# Altium schematic sheet P24_AUDIO.SchDoc
size 420 x 297 mm
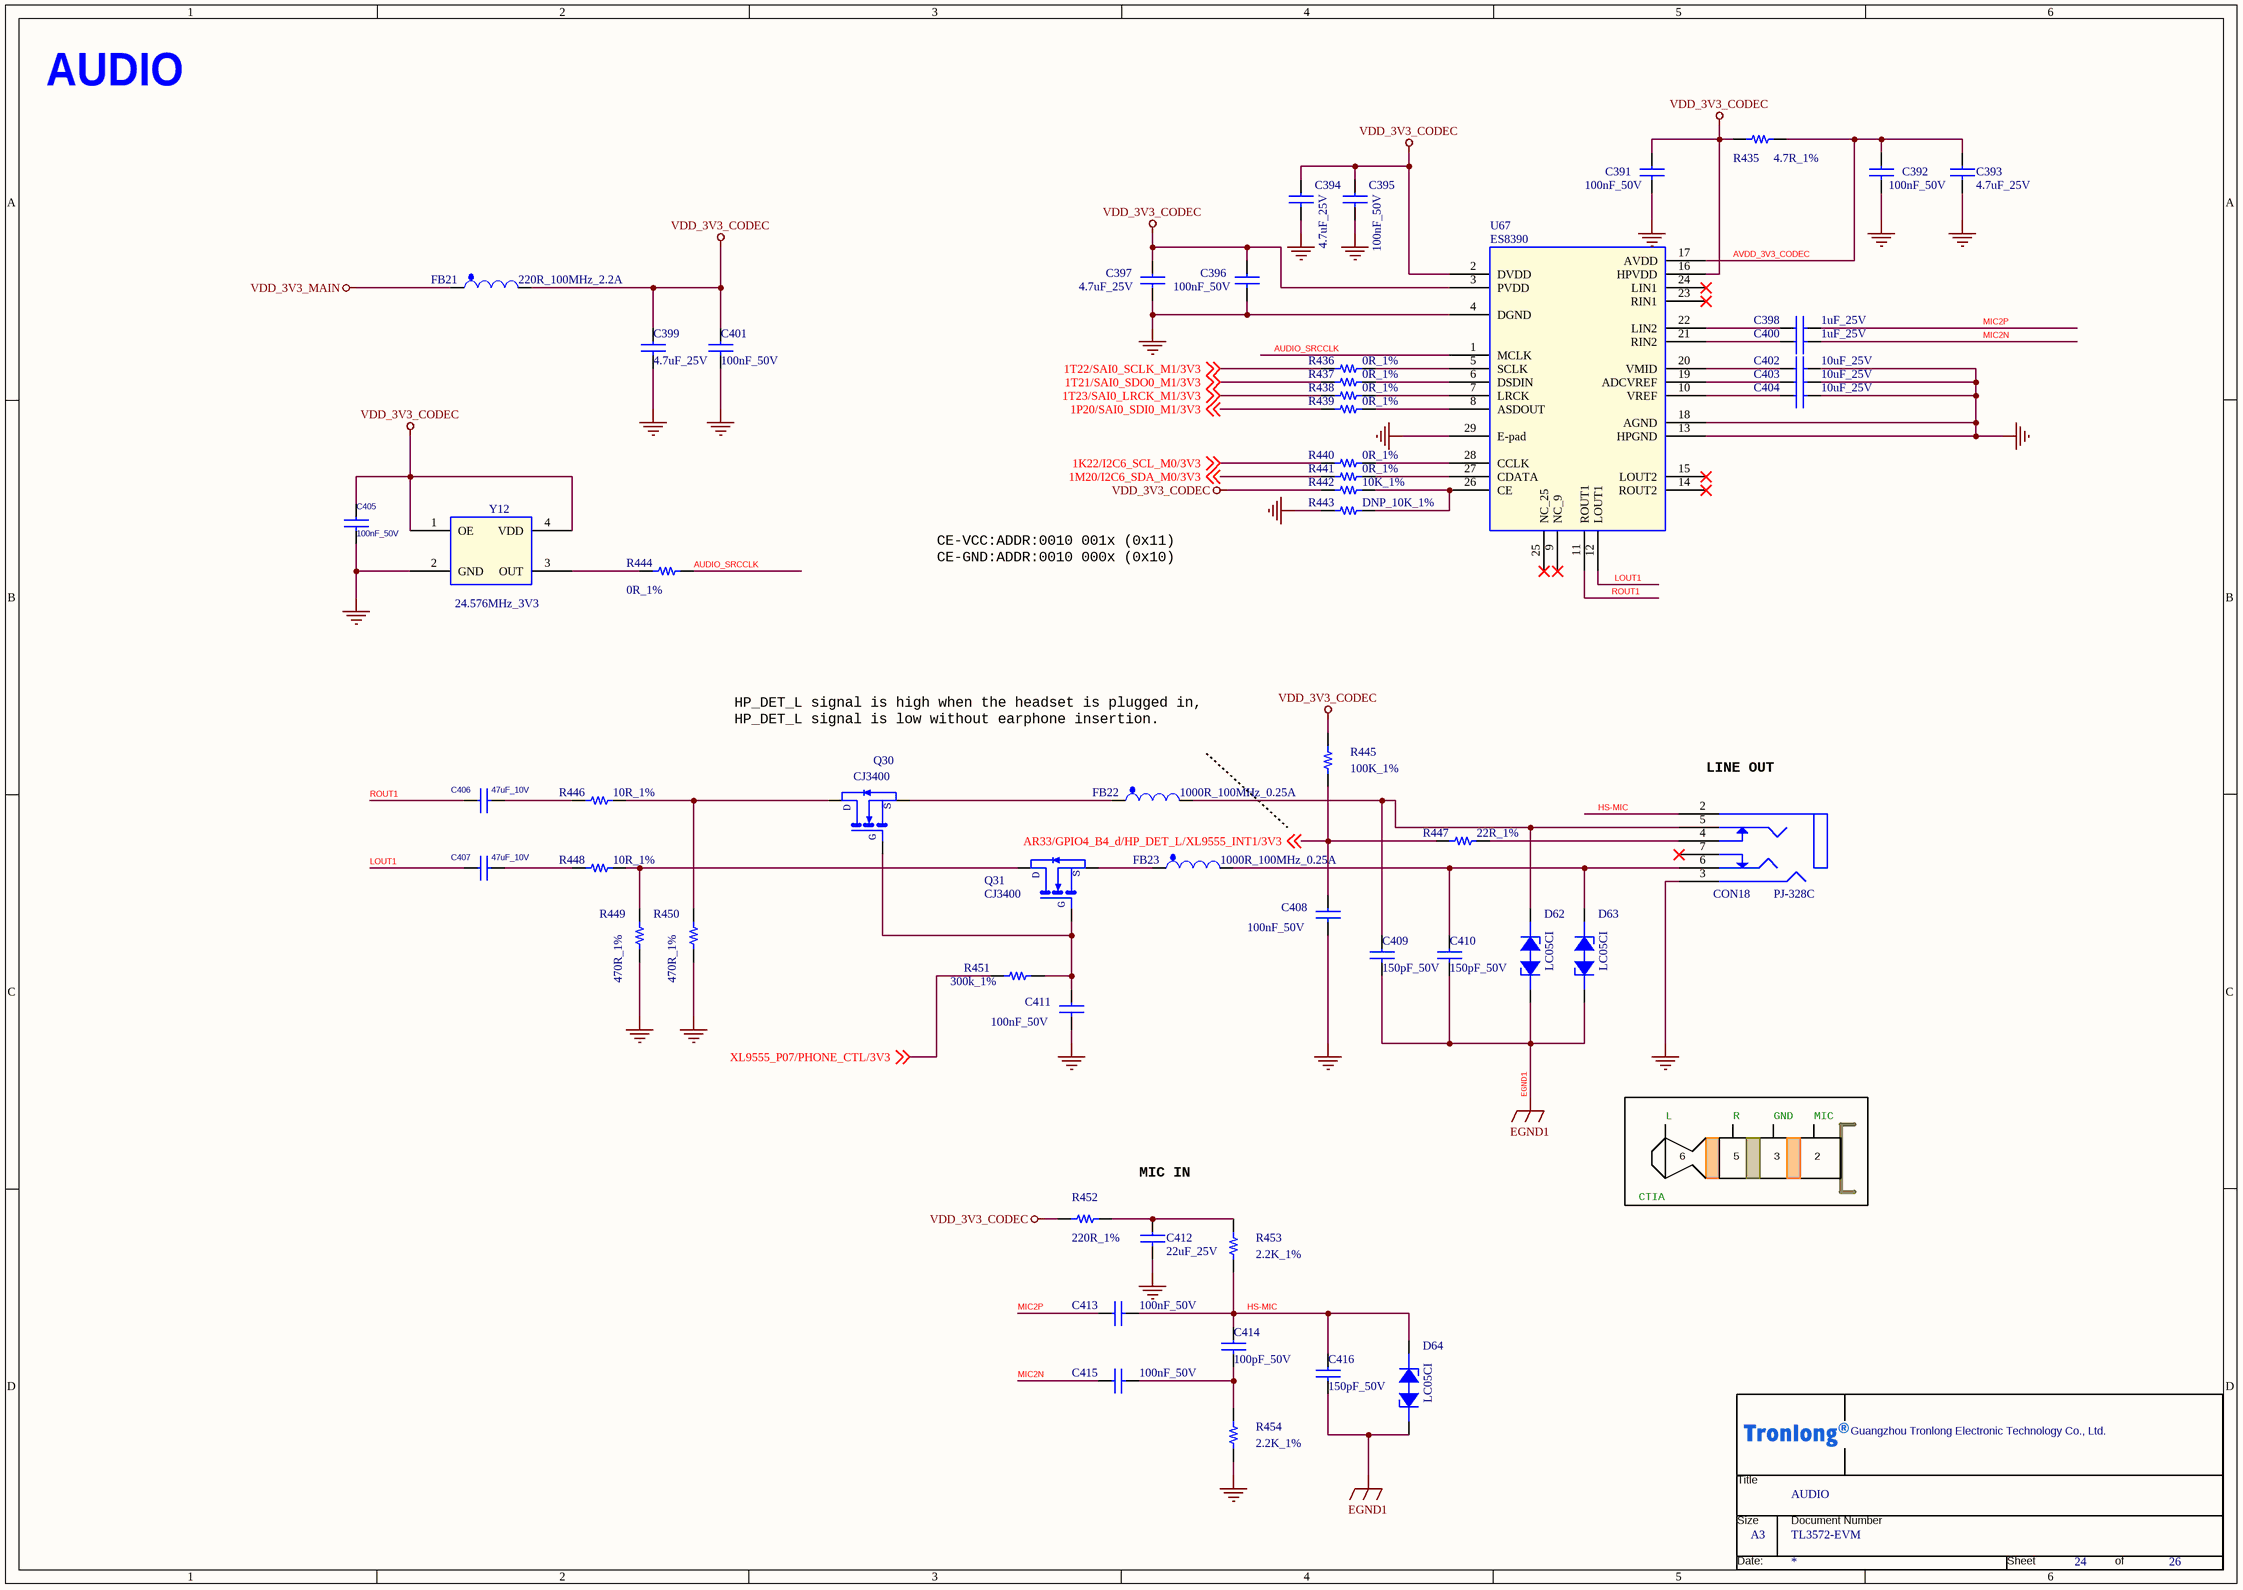
[diagram p0: P24_AUDIO.SchDoc]

## Parts
*  Page Count: 26  Page Number: 24  Page Size: A3  OrgName: Guangzhou Tronlong Electronic Technology Co., Ltd.  Title: AUDIO  Doc: TL3572-EVM  (hidden comment: TL_NEW)  (graphical)
C391  100nF_50V  [C0402]
C392  100nF_50V  [C0402]
C393  4.7uF_25V  [C0603]
C394  4.7uF_25V  [C0603]
C395  100nF_50V  [C0402]
C396  100nF_50V  [C0402]
C397  4.7uF_25V  [C0603]
C398  1uF_25V  [C0402]
C399  4.7uF_25V  [C0603]
C400  1uF_25V  [C0402]
C401  100nF_50V  [C0402]
C402  10uF_25V  [C0603]
C403  10uF_25V  [C0603]
C404  10uF_25V  [C0603]
C405  100nF_50V  [C0402]
C406  47uF_10V  [C0805]
C407  47uF_10V  [C0805]
C408  100nF_50V  [C0402]
C409  150pF_50V  [C0603]
C410  150pF_50V  [C0603]
C411  100nF_50V  [C0402]
C412  22uF_25V  [C0805]
C413  100nF_50V  [C0402]
C414  100pF_50V  [C0402]
C415  100nF_50V  [C0402]
C416  150pF_50V  [C0603]
CON18  PJ-328C  [PJ-328C]
D62  LC05CI  [SOD323]
D63  LC05CI  [SOD323]
D64  LC05CI  [SOD323]
FB21  220R_100MHz_2.2A  [L0603]
FB22  1000R_100MHz_0.25A  [L0402]
FB23  1000R_100MHz_0.25A  [L0402]
Q30  CJ3400  [SOT23-3]
Q31  CJ3400  [SOT23-3]
R435  4.7R_1%  [R0603]
R436  0R_1%  [R0402]
R437  0R_1%  [R0402]
R438  0R_1%  [R0402]
R439  0R_1%  [R0402]
R440  0R_1%  [R0402]
R441  0R_1%  [R0402]
R442  10K_1%  [R0402]
R443  DNP_10K_1%  [R0402]
R444  0R_1%  [R0603]
R445  100K_1%  [R0402]
R446  10R_1%  [R0603]
R447  22R_1%  [R0402]
R448  10R_1%  [R0603]
R449  470R_1%  [R0603]
R450  470R_1%  [R0603]
R451  300k_1%  [R0402]
R452  220R_1%  [R0603]
R453  2.2K_1%  [R0603]
R454  2.2K_1%  [R0603]
U67  ES8390  [QFN28_ES8388]
Y12  24.576MHz_3V3  [SMD_3225]

## Nets
EGND1: C409.2 C410.2 C416.2 D62.2(CATHODE2) D63.2(CATHODE2) D64.2(CATHODE2)
GND: C391.2 C392.2 C393.2 C394.2 C395.2 C396.2 C397.2 C399.2 C401.2 C402.2 C403.2 C404.2 C405.2 C408.2 C411.2 C412.2 CON18.3(GND) R443.1 R449.1 R450.1 R454.2 U67.4(DGND) U67.13(HPGND) U67.18(AGND) U67.29(E-pad) Y12.2(GND)
VDD_3V3_CODEC: C391.1 C394.1 C395.1 C396.1 C397.1 C399.1 C401.1 C405.1 FB21.2 R435.2 R442.1 R445.1 R452.1 U67.2(DVDD) U67.3(PVDD) U67.16(HPVDD) Y12.1(OE) Y12.4(VDD)
VDD_3V3_MAIN: FB21.1
1K22/I2C6_SCL_M0/3V3: R440.1 ; off-sheet 1K22/I2C6_SCL_M0/3V3
1M20/I2C6_SDA_M0/3V3: R441.1 ; off-sheet 1M20/I2C6_SDA_M0/3V3
1P20/SAI0_SDI0_M1/3V3: R439.1 ; off-sheet 1P20/SAI0_SDI0_M1/3V3
1T21/SAI0_SDO0_M1/3V3: R437.1 ; off-sheet 1T21/SAI0_SDO0_M1/3V3
1T22/SAI0_SCLK_M1/3V3: R436.1 ; off-sheet 1T22/SAI0_SCLK_M1/3V3
1T23/SAI0_LRCK_M1/3V3: R438.1 ; off-sheet 1T23/SAI0_LRCK_M1/3V3
AR33/GPIO4_B4_d/HP_DET_L/XL9555_INT1/3V3: C408.1 R445.2 R447.1 ; off-sheet AR33/GPIO4_B4_d/HP_DET_L/XL9555_INT1/3V3
AUDIO_SRCCLK: R444.2 U67.1(MCLK)
AVDD_3V3_CODEC: C392.1 C393.1 R435.1 U67.17(AVDD)
HS-MIC: C413.2 C414.1 C416.1 CON18.2(MIC) D64.1(ANODE1) R453.2
LOUT1: C407.1 U67.12(LOUT1)
MIC2N: C400.2 C415.1
MIC2P: C398.2 C413.1
ROUT1: C406.1 U67.11(ROUT1)
XL9555_P07/PHONE_CTL/3V3: R451.2 ; off-sheet XL9555_P07/PHONE_CTL/3V3
NetC398_1: C398.1 U67.22(LIN2)
NetC400_1: C400.1 U67.21(RIN2)
NetC402_1: C402.1 U67.20(VMID)
NetC403_1: C403.1 U67.19(ADCVREF)
NetC404_1: C404.1 U67.10(VREF)
NetC406_2: C406.2 R446.1
NetC407_2: C407.2 R448.1
NetC409_1: C409.1 CON18.5(R) D62.1(ANODE1) FB22.2
NetC410_1: C410.1 CON18.6(L) D63.1(ANODE1) FB23.2
NetC411_1: C411.1 Q30.1(B) Q31.1(B) R451.1
NetC412_1: C412.1 R452.2 R453.1
NetC414_2: C414.2 C415.2 R454.1
NetCON18_4: CON18.4(DETR) R447.2
NetFB22_1: FB22.1 Q30.2(E)
NetFB23_1: FB23.1 Q31.2(E)
NetQ30_3: Q30.3(C) R446.2 R450.2
NetQ31_3: Q31.3(C) R448.2 R449.2
NetR436_2: R436.2 U67.5(SCLK)
NetR437_2: R437.2 U67.6(DSDIN)
NetR438_2: R438.2 U67.7(LRCK)
NetR439_2: R439.2 U67.8(ASDOUT)
NetR440_2: R440.2 U67.28(CCLK)
NetR441_2: R441.2 U67.27(CDATA)
NetR442_2: R442.2 R443.2 U67.26(CE)
NetR444_1: R444.1 Y12.3(OUT)

Not connected (* = marked no-connect by the designer): CON18 7(DETL)*; U67 9(NC_9)* 14(ROUT2)* 15(LOUT2)* 23(RIN1)* 24(LIN1)* 25(NC_25)*

## Notes on the sheet
- AUDIO
- CE-VCC:ADDR:0010 001x (0x11)
  CE-GND:ADDR:0010 000x (0x10)
- HP_DET_L signal is high when the headset is plugged in,
  HP_DET_L signal is low without earphone insertion.
- (near CON18) LINE OUT
- L
- R
- GND
- MIC
- MIC IN
- CTIA
- 6
- 5
- 3
- 2
- (in symbol MMBT3904/SOT_1) S; D; G
- (in symbol TL_NEW) Title; Size; Document Number; Date:; Sheet; of

## Library data of the parts
* = TL_NEW: RevCode: A?; Page Create Date: March  8, 1995; Page Modify Date: *; Document: TL3572-EVM
C391 = CAP NP_Dup3: 贴片陶瓷电容,100nF,10%,50V,X7R; Manufacturer: 广东风华高新科技股份有限公司（FH）; Manufacturer Character: 中国大陆; Manufacturer PartNumber: 0402B104K500NT; As-Welded: /; ERP Number: 005.0001.0001.00681; Operation Temperature（℃）: -55~+125(Ta); Eco-Label: ROHS; Part Status: 试用; PCB Footprint: C0402
C392 = CAP NP_Dup3: 贴片陶瓷电容,100nF,10%,50V,X7R; Manufacturer Character: 中国大陆; Manufacturer PartNumber: 0402B104K500NT; Manufacturer: 广东风华高新科技股份有限公司（FH）; Eco-Label: ROHS; Operation Temperature（℃）: -55~+125(Ta); ERP Number: 005.0001.0001.00681; As-Welded: /; Part Status: 试用; PCB Footprint: C0402
C393 = CAP NP_Dup3: 贴片陶瓷电容,4.7uF,10%,25V,X5R; Manufacturer: 广东风华高新科技股份有限公司（FH）; Manufacturer PartNumber: 0603X475K250NT; Manufacturer Character: 中国大陆; Operation Temperature（℃）: -55~+85(Ta); As-Welded: /; ERP Number: 005.0001.0001.00566; Eco-Label: ROHS; Part Status: 优选; PCB Footprint: C0603
C394 C397 = CAP NP_Dup3: 贴片陶瓷电容,4.7uF,10%,25V,X5R; Manufacturer: 广东风华高新科技股份有限公司（FH）; Manufacturer Character: 中国大陆; Manufacturer PartNumber: 0603X475K250NT; Operation Temperature（℃）: -55~+85(Ta); As-Welded: /; ERP Number: 005.0001.0001.00566; Eco-Label: ROHS; Part Status: 优选; PCB Footprint: C0603
C395 = CAP NP_Dup3: 贴片陶瓷电容,100nF,10%,50V,X7R; Manufacturer PartNumber: 0402B104K500NT; Manufacturer Character: 中国大陆; Manufacturer: 广东风华高新科技股份有限公司（FH）; Eco-Label: ROHS; Operation Temperature（℃）: -55~+125(Ta); ERP Number: 005.0001.0001.00681; As-Welded: /; Part Status: 试用; PCB Footprint: C0402
C396 = CAP NP_Dup3: 贴片陶瓷电容,100nF,10%,50V,X7R; Manufacturer: 广东风华高新科技股份有限公司（FH）; Manufacturer PartNumber: 0402B104K500NT; Manufacturer Character: 中国大陆; As-Welded: /; ERP Number: 005.0001.0001.00681; Operation Temperature（℃）: -55~+125(Ta); Eco-Label: ROHS; Part Status: 试用; PCB Footprint: C0402
C398 C400 = CAP NP_Dup3: 贴片陶瓷电容,1uF,10%,25V,X5R; Manufacturer Character: 中国大陆; Manufacturer PartNumber: 0402X105K250NT; Manufacturer: 广东风华高新科技股份有限公司（FH）; Eco-Label: ROHS; ERP Number: 005.0001.0001.00640; As-Welded: /; Operation Temperature（℃）: -55~+85(Ta); Part Status: 试用; PCB Footprint: C0402
C399 = CAP NP_Dup3: 贴片陶瓷电容,4.7uF,10%,25V,X5R; Manufacturer Character: 中国大陆; Manufacturer PartNumber: 0603X475K250NT; Manufacturer: 广东风华高新科技股份有限公司（FH）; Eco-Label: ROHS; ERP Number: 005.0001.0001.00566; As-Welded: /; Operation Temperature（℃）: -55~+85(Ta); Part Status: 优选; PCB Footprint: C0603
C401 C408 C411 = CAP NP_Dup3: 贴片陶瓷电容,100nF,10%,50V,X7R; Manufacturer Character: 中国大陆; Manufacturer PartNumber: 0402B104K500NT; Manufacturer: 广东风华高新科技股份有限公司（FH）; Eco-Label: ROHS; ERP Number: 005.0001.0001.00681; Operation Temperature（℃）: -55~+125(Ta); As-Welded: /; Part Status: 试用; PCB Footprint: C0402
C402 = CAP NP_Dup3: 贴片陶瓷电容,10uF,20%,25V,X5R; Manufacturer PartNumber: 0603X106M250NT; Manufacturer Character: 中国大陆; Manufacturer: 广东风华高新科技股份有限公司（FH）; Eco-Label: ROHS; ERP Number: 005.0001.0001.00527; As-Welded: /; Operation Temperature（℃）: -55~+85(Ta); Part Status: 优选; PCB Footprint: C0603
C403 = CAP NP_Dup3: 贴片陶瓷电容,10uF,20%,25V,X5R; Manufacturer Character: 中国大陆; Manufacturer PartNumber: 0603X106M250NT; Manufacturer: 广东风华高新科技股份有限公司（FH）; As-Welded: /; Operation Temperature（℃）: -55~+85(Ta); ERP Number: 005.0001.0001.00527; Eco-Label: ROHS; Part Status: 优选; PCB Footprint: C0603
C404 = CAP NP_Dup3: 贴片陶瓷电容,10uF,20%,25V,X5R; Manufacturer: 广东风华高新科技股份有限公司（FH）; Manufacturer Character: 中国大陆; Manufacturer PartNumber: 0603X106M250NT; As-Welded: /; Operation Temperature（℃）: -55~+85(Ta); ERP Number: 005.0001.0001.00527; Eco-Label: ROHS; Part Status: 优选; PCB Footprint: C0603
C405 = CAP NP_Dup2: 贴片陶瓷电容,100nF,10%,50V,X7R; Manufacturer: 广东风华高新科技股份有限公司（FH）; Manufacturer PartNumber: 0402B104K500NT; Manufacturer Character: 中国大陆; Eco-Label: ROHS; As-Welded: /; Operation Temperature（℃）: -55~+125(Ta); ERP Number: 005.0001.0001.00681; Part Status: 试用; PCB Footprint: C0402
C406 C407 = CAP NP_Dup3: 贴片陶瓷电容,47uF,20%,10V,X5R; Manufacturer Character: 中国大陆; Manufacturer PartNumber: 0805X476M100NT; Manufacturer: 广东风华高新科技股份有限公司（FH）; Eco-Label: ROHS; ERP Number: 005.0001.0001.00621; As-Welded: /; Operation Temperature（℃）: -55~+85(Ta); Part Status: 试用; Temperature: -55~125℃; PCB Footprint: C0805
C409 = CAP NP_Dup2: 贴片陶瓷电容,150pF,5%,50V,COG; Manufacturer PN: C1005C0G1H101K050BA; Manufacturer: 广东风华高新科技股份有限公司（FH）; Manufacturer Character: 中国大陆; Manufacturer PartNumber: 0603CG151J500NT; As-Welded: /; Dielectric: C0G; Priority: A; Operation Temperature（℃）: -55~+125(Ta); ERP Number: 005.0001.0001.00611; Eco-Label: ROHS; Part Status: 试用; Part Type: C0402; RK PN: C1005C0G1H101K050BA; PCB Footprint: C0603
C410 C416 = CAP NP_Dup2: 贴片陶瓷电容,150pF,5%,50V,COG; Manufacturer PartNumber: 0603CG151J500NT; Manufacturer Character: 中国大陆; Manufacturer: 广东风华高新科技股份有限公司（FH）; ERP Number: 005.0001.0001.00611; Operation Temperature（℃）: -55~+125(Ta); RK PN: C1005C0G1H101K050BA; Priority: A; Dielectric: C0G; As-Welded: /; Eco-Label: ROHS; Part Status: 试用; Part Type: C0402; Manufacturer PN: C1005C0G1H101K050BA; PCB Footprint: C0603
C412 = CAP NP_Dup3: 贴片陶瓷电容,22uF,20%,25V,X5R; Manufacturer: 广东风华高新科技股份有限公司（FH）; Manufacturer Character: 中国大陆; Manufacturer PartNumber: 0805X226M250NT; Operation Temperature（℃）: -55~+85(Ta); As-Welded: /; ERP Number: 005.0001.0001.00524; Eco-Label: ROHS; Part Status: 优选; PCB Footprint: C0805
C413 C415 = CAP NP_Dup3: 贴片陶瓷电容,100nF,10%,50V,X7R; Manufacturer Character: 中国大陆; Manufacturer: 广东风华高新科技股份有限公司（FH）; Manufacturer PartNumber: 0402B104K500NT; Eco-Label: ROHS; ERP Number: 005.0001.0001.00681; As-Welded: /; Operation Temperature（℃）: -55~+125(Ta); RK PN: C1005C0G1H101K050BA; Priority: A; Dielectric: C0G; Part Type: C0402; Voltage: 50V; Tolerance: 10%; Manufacturer PN: C1005C0G1H101K050BA; Created by: JJJ; Part Status: 试用; PCB Footprint: C0402
C414 = CAP NP_Dup3: 贴片陶瓷电容,100pF,5%,50V,COG; Manufacturer PartNumber: 0402CG101J500NT; Manufacturer PN: C1005C0G1H101K050BA; Manufacturer: 广东风华高新科技股份有限公司（FH）; Manufacturer Character: 中国大陆; Tolerance: 10%; Dielectric: C0G; Priority: A; Operation Temperature（℃）: -55~+125(Ta); As-Welded: /; ERP Number: 005.0001.0001.00580; Eco-Label: EXEMPTION; Part Status: 优选; Created by: JJJ; Voltage: 50V; Part Type: C0402; RK PN: C1005C0G1H101K050BA; PCB Footprint: C0402
CON18 = PJ-328C_0: 插件音频连接器,孔径3.5mm,黑色; Manufacturer Character: 中国大陆; Manufacturer: 深圳市金航标电子有限公司(kinghelm); Eco-Label: ROHS; ERP Number: 005.0001.0003.00628; As-Welded: /; Part Status: 试用; Manufacturer PartNumber: PJ-328C; Operation Temperature（℃）: /; PCB Footprint: PJ-328C
D62 = DIODE BREAKDOWN_2: TVS二极管,VRWM=5V,VBR=6V,一组,双向,30KV,30KV; Manufacturer Character: 中国大陆; Manufacturer: 上海雷卯电子科技有限公司（Leiditech）; Eco-Label: ROHS; ERP Number: 005.0001.0017.00060; As-Welded: /; room: KEY; Operation Temperature（℃）: -55~+125(Tj); Manufacturer PartNumber: LC05CI; Manufacturer Part Number: LC05CI; Temperature: -55~125℃; Part Status: 优选; PCB Footprint: SOD323
D63 D64 = DIODE BREAKDOWN_2: TVS二极管,VRWM=5V,VBR=6V,一组,双向,30KV,30KV; Manufacturer: 上海雷卯电子科技有限公司（Leiditech）; Manufacturer Character: 中国大陆; Eco-Label: ROHS; ERP Number: 005.0001.0017.00060; As-Welded: /; Operation Temperature（℃）: -55~+125(Tj); room: KEY; Temperature: -55~125℃; Manufacturer Part Number: LC05CI; Manufacturer PartNumber: LC05CI; Part Status: 优选; PCB Footprint: SOD323
FB21 = FB_0: 磁珠,50mΩ,2.2A,220R@100MHz; Manufacturer PartNumber: UPZ1608U221-2R2TF; Manufacturer: 深圳顺络电子股份有限公司（Sunlord）; Manufacturer Character: 中国大陆; As-Welded: /; ERP Number: 005.0001.0007.00015; PCB Footprint Status: Checked; Standard PCB Footprint: 603; Purchase Information: 07558255526 小商行电子; Operation Temperature（℃）: -55~+125(Ta); Eco-Label: ROHS; Temperature: -55~125℃; Part Number: 647-01-3069; Part Type: BEAD; Price: 0.011; Part Status: 限选; PCB Footprint: L0603
FB22 = FB_0: 磁珠,900mΩ,0.25A,1000R@100MHz; Manufacturer Character: 中国大陆; Manufacturer: 广东风华高新科技股份有限公司(FH); Manufacturer PartNumber: CBW100505U102T; Eco-Label: ROHS; Operation Temperature（℃）: -55~+125(Ta); Purchase Information: 07558255526 小商行电子; Standard PCB Footprint: 603; PCB Footprint Status: Checked; ERP Number: 005.0001.0007.00021; As-Welded: /; Part Status: 试用; Price: 0.011; Part Type: BEAD; Part Number: 647-01-3069; Temperature: -55~125℃; PCB Footprint: L0402
FB23 = FB_0: 磁珠,900mΩ,0.25A,1000R@100MHz; Manufacturer PartNumber: CBW100505U102T; Manufacturer: 广东风华高新科技股份有限公司(FH); Manufacturer Character: 中国大陆; As-Welded: /; ERP Number: 005.0001.0007.00021; PCB Footprint Status: Checked; Standard PCB Footprint: 603; Purchase Information: 07558255526 小商行电子; Operation Temperature（℃）: -55~+125(Ta); Eco-Label: ROHS; Temperature: -55~125℃; Part Number: 647-01-3069; Part Type: BEAD; Price: 0.011; Part Status: 试用; PCB Footprint: L0402
Q30 = MMBT3904/SOT_1: MOSFET,N沟道,VDSS=30V,VGSS=±12V,ID=5.8A,PD=0.35W,VGS(th)=1.4V; Manufacturer: 江苏长晶科技股份有限公司（JSCJ）; Manufacturer Character: 中国大陆; Eco-Label: ROHS; ERP Number: 005.0001.0009.00027; As-Welded: /; Operation Temperature（℃）: -55~+150(Tj); ROOM: DSP_LED; Part Status: 优选; Manufacturer PartNumber: CJ3400; PCB Footprint: SOT23-3
Q31 = MMBT3904/SOT_1: MOSFET,N沟道,VDSS=30V,VGSS=±12V,ID=5.8A,PD=0.35W,VGS(th)=1.4V; Manufacturer Character: 中国大陆; Manufacturer: 江苏长晶科技股份有限公司（JSCJ）; ROOM: DSP_LED; Operation Temperature（℃）: -55~+150(Tj); As-Welded: /; ERP Number: 005.0001.0009.00027; Eco-Label: ROHS; Manufacturer PartNumber: CJ3400; Part Status: 优选; PCB Footprint: SOT23-3
R435 = Resistor_Dup4: /; Manufacturer PartNumber: 4.7R,±1%,R0603,≥1/10W; Manufacturer: 广州创龙; CLASS: DISCRETE; Eco-Label: ROHS; ERP Number: 005.0001.0023.00441; Operation Temperature（℃）: -40~+85(Ta); As-Welded: /; Manufacturer Character: -; Part Status: -; PCB Footprint: R0603
R436 R437 = Resistor_Dup4: 贴片电阻,0R,±1%,1/16W; Manufacturer: 广东风华高新科技股份有限公司（FH）; Manufacturer PartNumber: RC-02000FT; Manufacturer Character: 中国大陆; CLASS: DISCRETE; Operation Temperature（℃）: -55~+155(Ta); AGILE_PN: 470-75394; Tolerance: 5%; MFG_NAME01: ROHM; MFG_PN01: MCR01MZPJ000; CAD_APPROVED: Yes; FPLIST: RC0402_25,RC0402_HD,RC0402_X2,0402_CC; As-Welded: /; ERP Number: 005.0001.0002.00938; Eco-Label: ROHS; ROHS: Yes; HEIGHT: 0.45 MM; Part Status: 优选; PCB Footprint: R0402
R438 R439 R441 = Resistor_Dup4: 贴片电阻,0R,±1%,1/16W; Manufacturer Character: 中国大陆; Manufacturer PartNumber: RC-02000FT; Manufacturer: 广东风华高新科技股份有限公司（FH）; CLASS: DISCRETE; Eco-Label: ROHS; ERP Number: 005.0001.0002.00938; As-Welded: /; FPLIST: RC0402_25,RC0402_HD,RC0402_X2,0402_CC; CAD_APPROVED: Yes; MFG_PN01: MCR01MZPJ000; MFG_NAME01: ROHM; Tolerance: 5%; AGILE_PN: 470-75394; Operation Temperature（℃）: -55~+155(Ta); Part Status: 优选; HEIGHT: 0.45 MM; ROHS: Yes; PCB Footprint: R0402
R440 = Resistor_Dup4: 贴片电阻,0R,±1%,1/16W; Manufacturer Character: 中国大陆; Manufacturer PartNumber: RC-02000FT; Manufacturer: 广东风华高新科技股份有限公司（FH）; CLASS: DISCRETE; Eco-Label: ROHS; ERP Number: 005.0001.0002.00938; As-Welded: /; Operation Temperature（℃）: -55~+155(Ta); AGILE_PN: 470-75394; Tolerance: 5%; MFG_NAME01: ROHM; MFG_PN01: MCR01MZPJ000; CAD_APPROVED: Yes; FPLIST: RC0402_25,RC0402_HD,RC0402_X2,0402_CC; Part Status: 优选; ROHS: Yes; HEIGHT: 0.45 MM; PCB Footprint: R0402
R442 = Resistor_Dup4: 贴片电阻,10K,±1%,1/16W; Manufacturer: 广东风华高新科技股份有限公司（FH）; Manufacturer PartNumber: RC-02K1002FT; Manufacturer Character: 中国大陆; CLASS: DISCRETE; Eco-Label: ROHS; Operation Temperature（℃）: -55~+125(Ta); AGILE_PN: 470-75394; Tolerance: 5%; MFG_NAME01: ROHM; MFG_PN01: MCR01MZPJ000; CAD_APPROVED: Yes; FPLIST: RC0402_25,RC0402_HD,RC0402_X2,0402_CC; ERP Number: 005.0001.0002.01326; As-Welded: /; ROHS: Yes; HEIGHT: 0.45 MM; Part Status: 优选; PCB Footprint: R0402
R443 = Resistor_Dup4: 贴片电阻,10K,±1%,1/16W; Manufacturer Character: 中国大陆; Manufacturer PartNumber: RC-02K1002FT; Manufacturer: 广东风华高新科技股份有限公司（FH）; CLASS: DISCRETE; As-Welded: DNP; ERP Number: 005.0001.0002.01326; FPLIST: RC0402_25,RC0402_HD,RC0402_X2,0402_CC; CAD_APPROVED: Yes; MFG_PN01: MCR01MZPJ000; MFG_NAME01: ROHM; Tolerance: 5%; AGILE_PN: 470-75394; Operation Temperature（℃）: -55~+125(Ta); Eco-Label: ROHS; Part Status: 优选; HEIGHT: 0.45 MM; ROHS: Yes; PCB Footprint: R0402
R444 = Resistor_Dup3: 贴片电阻,0R,±1%,1/10W; Manufacturer: 广东风华高新科技股份有限公司（FH）; Manufacturer PartNumber: RS-03000FT; Manufacturer Character: 中国大陆; CLASS: DISCRETE; Eco-Label: ROHS; As-Welded: /; room: RS232; Operation Temperature（℃）: -55~+155(Ta); ERP Number: 005.0001.0002.00956; Part Status: 优选; PCB Footprint: R0603
R445 = Resistor_Dup4: RC0402FR-07100KL,0402WGF1003TCE; Manufacturer: 广州创龙; Manufacturer PartNumber: 100K,±1%,R0402,≥1/16W; CLASS: DISCRETE; FPLIST: RC0402_25,RC0402_HD,RC0402_X2,0402_CC; CAD_APPROVED: Yes; MFG_PN01: MCR01MZPJ000; MFG_NAME01: ROHM; Tolerance: 5%; AGILE_PN: 470-75394; Operation Temperature（℃）: -40~+85(Ta); As-Welded: /; ERP Number: 005.0001.0023.00025; Eco-Label: ROHS; Manufacturer Character: -; HEIGHT: 0.45 MM; ROHS: Yes; Temperature: -55~155℃; Part Status: -; PCB Footprint: R0402
R446 = Resistor_Dup4: 贴片电阻,10R,±1%,1/10W; Manufacturer: 广东风华高新科技股份有限公司（FH）; Manufacturer PartNumber: RS-03K10R0FT; Manufacturer Character: 中国大陆; CLASS: DISCRETE; FPLIST: RC0402_25,RC0402_HD,RC0402_X2,0402_CC; CAD_APPROVED: Yes; MFG_PN01: MCR01MZPJ000; MFG_NAME01: ROHM; Tolerance: 5%; AGILE_PN: 470-75394; Operation Temperature（℃）: -55~+155(Ta); As-Welded: /; ERP Number: 005.0001.0002.00974; Eco-Label: ROHS; HEIGHT: 0.45 MM; ROHS: Yes; Part Status: 优选; PCB Footprint: R0603
R447 = Resistor_Dup4: 贴片电阻,22R,±1%,1/16W; Manufacturer: 广东风华高新科技股份有限公司（FH）; Manufacturer PartNumber: RC-02K22R0FT; Manufacturer Character: 中国大陆; CLASS: DISCRETE; As-Welded: /; Operation Temperature（℃）: -55~+125(Ta); AGILE_PN: 470-75394; Tolerance: 5%; MFG_NAME01: ROHM; MFG_PN01: MCR01MZPJ000; CAD_APPROVED: Yes; FPLIST: RC0402_25,RC0402_HD,RC0402_X2,0402_CC; ERP Number: 005.0001.0002.01316; Eco-Label: ROHS; ROHS: Yes; HEIGHT: 0.45 MM; Part Status: 试用; PCB Footprint: R0402
R448 = Resistor_Dup4: 贴片电阻,10R,±1%,1/10W; Manufacturer Character: 中国大陆; Manufacturer PartNumber: RS-03K10R0FT; Manufacturer: 广东风华高新科技股份有限公司（FH）; CLASS: DISCRETE; As-Welded: /; ERP Number: 005.0001.0002.00974; FPLIST: RC0402_25,RC0402_HD,RC0402_X2,0402_CC; CAD_APPROVED: Yes; MFG_PN01: MCR01MZPJ000; MFG_NAME01: ROHM; Tolerance: 5%; AGILE_PN: 470-75394; Operation Temperature（℃）: -55~+155(Ta); Eco-Label: ROHS; Part Status: 优选; HEIGHT: 0.45 MM; ROHS: Yes; PCB Footprint: R0603
R449 R450 = Resistor_Dup4: 贴片电阻,470R,±1%,1/10W; Manufacturer Character: 中国大陆; Manufacturer PartNumber: RS-03K4700FT; Manufacturer: 广东风华高新科技股份有限公司（FH）; CLASS: DISCRETE; Eco-Label: ROHS; ERP Number: 005.0001.0002.01346; As-Welded: /; FPLIST: RC0402_25,RC0402_HD,RC0402_X2,0402_CC; CAD_APPROVED: Yes; MFG_PN01: MCR01MZPJ000; MFG_NAME01: ROHM; Tolerance: 5%; AGILE_PN: 470-75394; Operation Temperature（℃）: -55~+125(Ta); Part Status: 试用; HEIGHT: 0.45 MM; ROHS: Yes; PCB Footprint: R0603
R451 = Resistor_Dup4: 贴片电阻,300K,±1%,1/16W; Manufacturer: 广东风华高新科技股份有限公司（FH）; Manufacturer PartNumber: RC-02K3003FT; Manufacturer Character: 中国大陆; CLASS: DISCRETE; Operation Temperature（℃）: -55~+155(Ta); AGILE_PN: 470-75394; Tolerance: 5%; MFG_NAME01: ROHM; MFG_PN01: MCR01MZPJ000; CAD_APPROVED: Yes; FPLIST: RC0402_25,RC0402_HD,RC0402_X2,0402_CC; As-Welded: /; ERP Number: 005.0001.0002.01464; Eco-Label: ROHS; Part Status: 测评; ROHS: Yes; HEIGHT: 0.45 MM; PCB Footprint: R0402
R452 = Resistor_Dup4: 贴片电阻,220R,±1%,1/10W; Manufacturer Character: 中国大陆; Manufacturer PartNumber: RS-03K2200FT; Manufacturer: 广东风华高新科技股份有限公司（FH）; CLASS: DISCRETE; Eco-Label: ROHS; ERP Number: 005.0001.0002.01296; As-Welded: /; Operation Temperature（℃）: -55~+155(Ta); AGILE_PN: 470-75394; Tolerance: 5%; MFG_NAME01: ROHM; MFG_PN01: MCR01MZPJ000; CAD_APPROVED: Yes; FPLIST: RC0402_25,RC0402_HD,RC0402_X2,0402_CC; ROHS: Yes; HEIGHT: 0.45 MM; Part Status: 试用; PCB Footprint: R0603
R453 R454 = Resistor_Dup4: 贴片电阻,2.2K,±1%,1/10W; Manufacturer Character: 中国大陆; Manufacturer PartNumber: RS-03K2201FT; Manufacturer: 广东风华高新科技股份有限公司（FH）; CLASS: DISCRETE; Eco-Label: ROHS; ERP Number: 005.0001.0002.00972; As-Welded: /; Operation Temperature（℃）: -55~+155(Ta); AGILE_PN: 470-75394; Tolerance: 5%; MFG_NAME01: ROHM; MFG_PN01: MCR01MZPJ000; CAD_APPROVED: Yes; FPLIST: RC0402_25,RC0402_HD,RC0402_X2,0402_CC; ROHS: Yes; HEIGHT: 0.45 MM; Part Status: 优选; PCB Footprint: R0603
U67 = Amplifier_ES8388: 立体声音频编解码器; Manufacturer: 苏州顺芯半导体有限公司（Everest）; Manufacturer Character: 国外; RK PN: ES8388; Priority: A; Operation Temperature（℃）: -40~125(Ta); As-Welded: /; ERP Number: 005.0001.0004.01347; Eco-Label: ROHS; PCB Footprint: QFN28_ES8388; Part Status: 测评; Manufacturer PartNumber: ES8390; Part Type: Amplifier; Manufacturer PN: ES8388; Created by: JJJ
Y12 = CMX309: 四脚有源晶振,24.576MHz,3.3V,CMOS,±30ppm; Manufacturer Character: 中国大陆; Manufacturer: 深圳市星通时频电子有限公司（SCTF）; Mfr_Part_Number: S3M24.576B20F30TNN; Mfr_Name: Citizen; ERP Number: 005.0001.0005.00129; room: 14; As-Welded: /; Operation Temperature（℃）: -40~+85(Ta); Eco-Label: ROHS; PCB Footprint: SMD_3225; Part Status: 试用; ROHS: Yes; DATASHEET_PATH: M:\OrCad\CIS_database\Logic_Data_Sheets\Crystals_Oscillators\Citizen\CSX_750F.pdf; WEB_LINK: http://LPDSRV18.logicpd.com:8010/Everest_LOGIC/HcmServlet?action=OpenEmailObject&classid=21&objid=6273689; Manufacturer PartNumber: S3M24.576B20F30TNN; Temperature: -40~85℃